# EAGLE schematic handle (EAGLE 9.2.0)
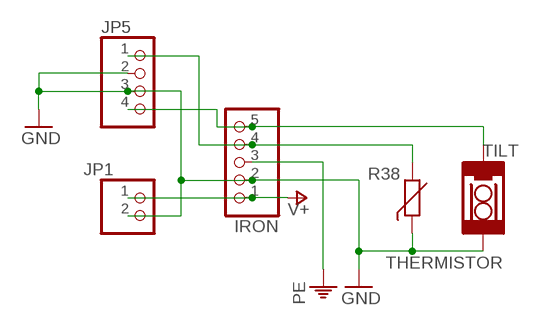
[diagram p0: schematic, sheet 1]

## Parts
IRON  PINHD-1X5  [1X05]
JP1  PINHD-1X2  [1X02]
JP5  PINHD-1X4  [1X04]
R38  THERMISTOR  THERMISTOR_R-2,5  [RS-2,5]
TILT  SQ-SEN-200  [SQ-SEN-200]

## Nets
GND: IRON.2 JP1.2 JP5.2 JP5.3 R38.1 TILT.2
N$5: IRON.4 JP5.1 R38.2
N$6: IRON.5 JP5.4 TILT.1
PE: IRON.3
V+: IRON.1 JP1.1

## Library data of the parts
IRON = pinhead:PINHD-1X5: PIN HEADER
JP1 = pinhead:PINHD-1X2: PIN HEADER
JP5 = pinhead:PINHD-1X4: PIN HEADER
R38 = discrete:THERMISTOR_: Thermo Resistor
TILT = sensor-signalquest:SQ-SEN-200: TILT AND VIBRATION SENSOR OMNIDIRECTIONAL